# Altium schematic sheet AAI.SchDoc
size A3
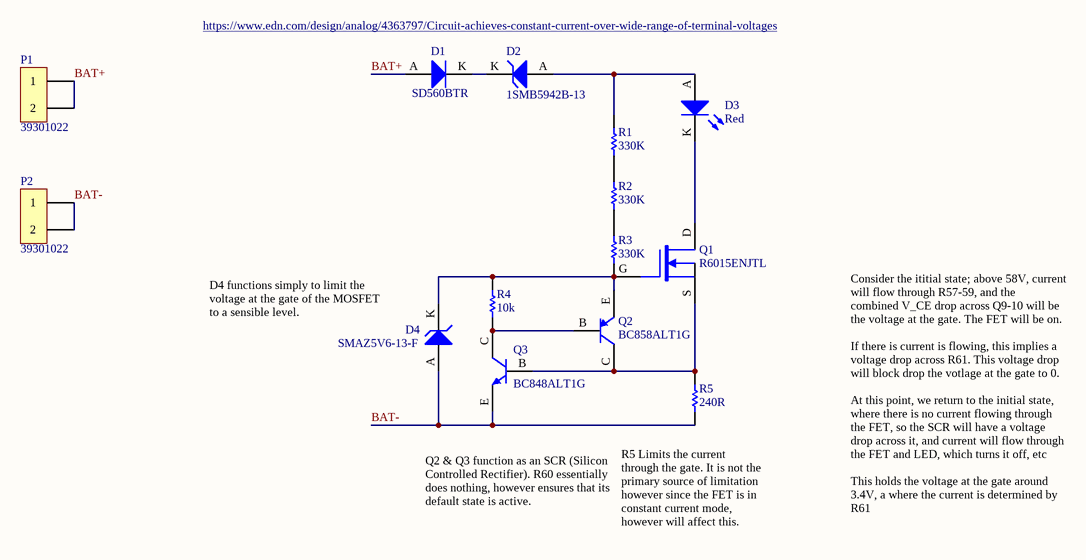
[diagram p0: AAI.SchDoc]

## Parts
D1  SD560BTR  [SMB Diode]
D2  1SMB5942B-13  [DI SMB Diode]
D3  Red  [0805 LED]
D4  SMAZ5V6-13-F  [DI SMA Diode]
P1  39301022  [39301022]
P2  39301022  [39301022]
Q1  R6015ENJTL  [R TO-263 N-MOSFET]
Q2  BC858ALT1G  [ON TO-236-3 BJT]
Q3  BC848ALT1G  [ON TO-236-3 BJT]
R1  330K  [VB 0207]
R2  330K  [VB 0207]
R3  330K  [VB 0207]
R4  10k  [0805]
R5  240R  [0805]

## Nets
BAT+: D1.A P1.1 P1.2
BAT-: D4.A P2.1 P2.2 Q3.E R5.1
NetD1_K: D1.K D2.K
NetD2_A: D2.A D3.A R1.2
NetD3_K: D3.K Q1.D
NetD4_K: D4.K Q1.G Q2.E R3.1 R4.2
NetQ1_S: Q1.S Q2.C Q3.B R5.2
NetQ2_B: Q2.B Q3.C R4.1
NetR1_1: R1.1 R2.2
NetR2_1: R2.1 R3.2

## Notes on the sheet
- https://www.edn.com/design/analog/4363797/Circuit-achieves-constant-current-over-wide-range-of-terminal-voltages
- (near D4) D4 functions simply to limit the voltage at the gate of the MOSFET to a sensible level.
- Consider the ititial state; above 58V, current will flow through R57-59, and the combined V_CE drop across Q9-10 will be the voltage at the gate. The FET will be on.
  If there is current is flowing, this implies a voltage drop across R61. This voltage drop will block drop the votlage at the gate to 0.
  At this point, we return to the initial state, where there is no current flowing through the FET, so the SCR will have a voltage drop across it, and current will flow through the FET and LED, which turns it off, etc
  This holds the voltage at the gate around 3.4V, a where the current is determined by R61
  This process will occur in a continueous process until power is lost.
- Q2 & Q3 function as an SCR (Silicon Controlled Rectifier). R60 essentially does nothing, however ensures that its default state is active.
- (near R5) R5 Limits the current through the gate. It is not the primary source of limitation however since the FET is in constant current mode, however will affect this.

## Library data of the parts
D1 = SD560BTR: 1.2V_F 600V 5A SMB; Manufacturer: SMC Diode Solutions; Part Number: SD560BTR; Digikey Part Number: 1655-1530-2-ND; Digikey Link: https://www.digikey.com/product-detail/en/smc-diode-solutions/SD560BTR/1655-1530-2-ND/6022620
D2 = 1SMB5942B-13: DIODE ZENER 51V 3W SMB; Manufacturer: Diodes Inc; Part Number: 1SMB5942B-13; Digikey Part Number: 1SMB5942B-13DICT-ND; Digikey Link: https://www.digikey.com/product-detail/en/diodes-incorporated/1SMB5942B-13/1SMB5942B-13DICT-ND/5054245
D3 = SML-210LTT86: Red LED Indication - Discrete 1.75V 0805 (2012 Metric); Manufacturer: ROHM Semiconductor; Part Number: SML-210LTT86; Colour: Red; Digikey Part Number: 511-1286-1-ND; Digikey Link: https://www.digikey.com/product-detail/en/rohm-semiconductor/SML-210LTT86/511-1286-1-ND/637099
D4 = SMAZ5V6-13-F: DIODE ZENER 5.6V 1W SMA; Manufacturer: Diodes Inc; Part Number: SMAZ5V6-13-F; Digikey Part Number: SMAZ5V6-FDICT-ND; Digikey Link: https://www.digikey.com/product-detail/en/diodes-incorporated/SMAZ5V6-13-F/SMAZ5V6-FDICT-ND/755500
P1 P2 = 39301022: Positions: 2; Pitch: 4.20mm; Row Spacing: 4.2mm; Angle: 90; Flange: No; Contact: Gold; Part Number: 39301022; Digikey Part Number: WM21363-ND; Digikey Link: https://www.digikey.com/product-detail/en/molex/0039301022/WM21363-ND/930332
Q1 = R6015ENJTL: MOSFET N-CH 600V 15A LPT; Manufacturer: Rohm Semiconductor; Published: 24-Mar-1999; LatestRevisionDate: 29-May-2009; LatestRevisionNote: IPC-7351 Footprint Added.; PackageVersion: Sep-2000; PackageReference: SOT-343; Publisher: Altium Limited; PackageDescription: 4-Pin SOT-343 Package 1.3 mm Pitch, 2.1 mm Lead Span; Part Number: R6015ENJTL; Digikey Part Number: R6015ENJTLCT-ND; Digikey Link: https://www.digikey.com.au/product-detail/en/rohm-semiconductor/R6015ENJTL/R6015ENJTLCT-ND/5042516
Q2 = BC858ALT1G: TRANS PNP 30V 0.1A SOT-23; Manufacturer: ON Semiconductor; Part Number: BC858ALT1G; Digikey Part Number: BC858ALT1GOSCT-ND; Digikey Link: https://www.digikey.com.au/product-detail/en/on-semiconductor/BC858ALT1G/BC858ALT1GOSCT-ND/3462248?fbclid=IwAR0XE0JmsZu1bfxkpmh7_fMKeVVYT41RbargOB6Kv0hZlYRUvP_HzrN_yXU
Q3 = BC848ALT1G: TRANS NPN 30V 0.1A SOT23; Manufacturer: ON Semiconductor; Part Number: BC848ALT1G; Digikey Part Number: BC848ALT1GOSCT-ND; Digikey Link: https://www.digikey.com/product-detail/en/on-semiconductor/BC848ALT1G/BC848ALT1GOSCT-ND/917837
R1-R3 = MMB02070C3303FB200: Manufacturer: Vishay Beyschlag; Tolerance: 0.01; Rated Voltage: 1W; Part Number: MMB02070C3303FB200; Value: 330K; Digikey Part Number: MMB-330KBCT-ND
R4 = RC0805FR0710KL: Manufacturer: YAGEO; Tolerance: 0.01; Rated Voltage: 0.125W; Part Number: RC0805FR0710KL; Value: 10k; Material: FR-07
R5 = RC0805FR07240RL: Manufacturer: YAGEO; Tolerance: 0.01; Rated Voltage: 0.125W; Part Number: RC0805FR07240RL; Value: 240R; Material: FR-07